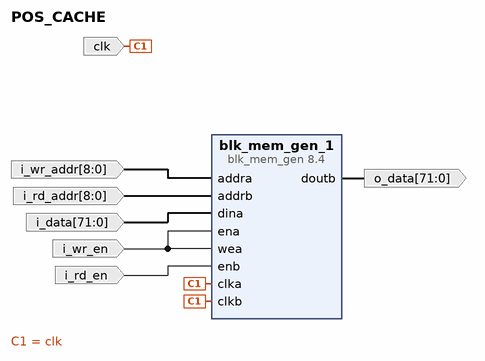
[diagram p0: block diagram of the top level]
# Vivado block design POS_CACHE, xcu280-fsvh2892-2L-e, Vivado 2021.2
create_bd_design POS_CACHE

create_bd_port -dir I -type clk clk
set_property -dict {CONFIG.PHASE 0.000} [get_bd_ports clk]
create_bd_port -dir I -from 71 -to 0 i_data
create_bd_port -dir I -from 8 -to 0 i_rd_addr
create_bd_port -dir I i_rd_en
create_bd_port -dir I -from 8 -to 0 i_wr_addr
create_bd_port -dir I i_wr_en
create_bd_port -dir O -from 71 -to 0 o_data

create_bd_cell -type ip -vlnv xilinx.com:ip:blk_mem_gen:8.4 blk_mem_gen_1
set_property -dict [list \
  CONFIG.Enable_32bit_Address false \
  CONFIG.Memory_Type Simple_Dual_Port_RAM \
  CONFIG.Operating_Mode_A NO_CHANGE \
  CONFIG.PRIM_type_to_Implement URAM \
  CONFIG.Port_B_Clock 100 \
  CONFIG.Port_B_Enable_Rate 100 \
  CONFIG.Use_Byte_Write_Enable false \
  CONFIG.Use_RSTB_Pin false \
  CONFIG.Write_Depth_A 512 \
  CONFIG.Write_Width_A 72 \
  CONFIG.use_bram_block Stand_Alone \
] [get_bd_cells blk_mem_gen_1]

# ---- connections ----

connect_bd_net -net addra_0_1 [get_bd_ports i_wr_addr] [get_bd_pins blk_mem_gen_1/addra]
connect_bd_net -net addrb_0_1 [get_bd_ports i_rd_addr] [get_bd_pins blk_mem_gen_1/addrb]
connect_bd_net -net blk_mem_gen_0_doutb [get_bd_pins blk_mem_gen_1/doutb] [get_bd_ports o_data]
connect_bd_net -net clka_0_1 [get_bd_ports clk] [get_bd_pins blk_mem_gen_1/clka] [get_bd_pins blk_mem_gen_1/clkb]
connect_bd_net -net dina_0_1 [get_bd_ports i_data] [get_bd_pins blk_mem_gen_1/dina]
connect_bd_net -net ena_0_1 [get_bd_ports i_wr_en] [get_bd_pins blk_mem_gen_1/ena] [get_bd_pins blk_mem_gen_1/wea]
connect_bd_net -net enb_0_1 [get_bd_ports i_rd_en] [get_bd_pins blk_mem_gen_1/enb]

validate_bd_design
save_bd_design
